# EAGLE design BMS (EAGLE 9.6.2)
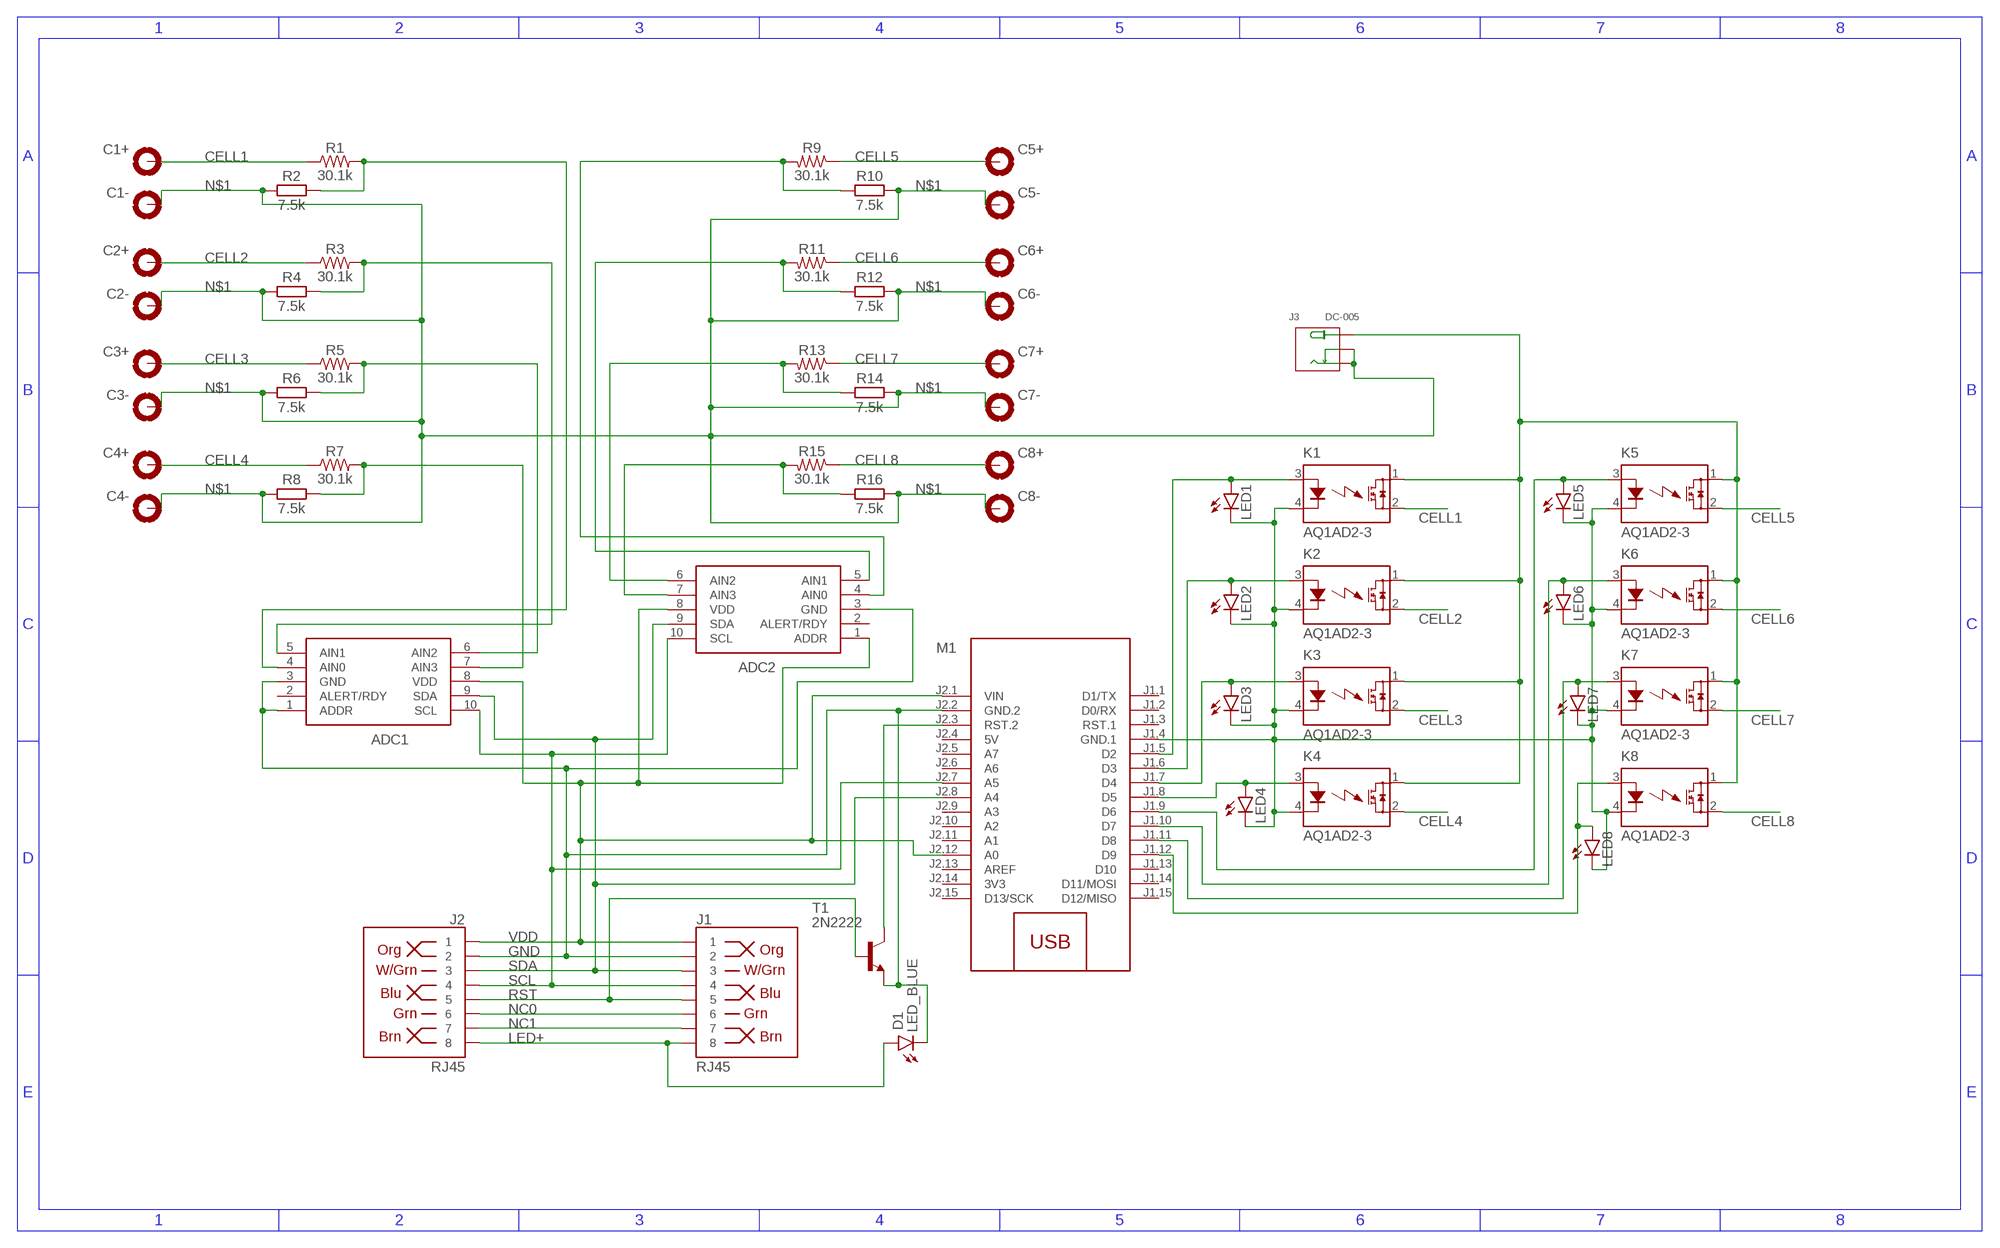
[diagram p0: schematic, sheet 1]

## Parts
ADC1  ADS1115IDGST  [SOP50P490X110-10N]
ADC2  ADS1115IDGST  [SOP50P490X110-10N]
C1+  HOLES_MOUNT-PAD-ROUND-0.096-NS  [HOLES_096-PAD-NS]
C1-  HOLES_MOUNT-PAD-ROUND-0.096-NS  [HOLES_096-PAD-NS]
C2+  HOLES_MOUNT-PAD-ROUND-0.096-NS  [HOLES_096-PAD-NS]
C2-  HOLES_MOUNT-PAD-ROUND-0.096-NS  [HOLES_096-PAD-NS]
C3+  HOLES_MOUNT-PAD-ROUND-0.096-NS  [HOLES_096-PAD-NS]
C3-  HOLES_MOUNT-PAD-ROUND-0.096-NS  [HOLES_096-PAD-NS]
C4+  HOLES_MOUNT-PAD-ROUND-0.096-NS  [HOLES_096-PAD-NS]
C4-  HOLES_MOUNT-PAD-ROUND-0.096-NS  [HOLES_096-PAD-NS]
C5+  HOLES_MOUNT-PAD-ROUND-0.096-NS  [HOLES_096-PAD-NS]
C5-  HOLES_MOUNT-PAD-ROUND-0.096-NS  [HOLES_096-PAD-NS]
C6+  HOLES_MOUNT-PAD-ROUND-0.096-NS  [HOLES_096-PAD-NS]
C6-  HOLES_MOUNT-PAD-ROUND-0.096-NS  [HOLES_096-PAD-NS]
C7+  HOLES_MOUNT-PAD-ROUND-0.096-NS  [HOLES_096-PAD-NS]
C7-  HOLES_MOUNT-PAD-ROUND-0.096-NS  [HOLES_096-PAD-NS]
C8+  HOLES_MOUNT-PAD-ROUND-0.096-NS  [HOLES_096-PAD-NS]
C8-  HOLES_MOUNT-PAD-ROUND-0.096-NS  [HOLES_096-PAD-NS]
D1  LED_BLUE  LED_RADIAL_BLUE  [LEDRD254W60D565H860B_B]
J1  RJ45  RJ45-8  [RJ45-8]
J2  RJ45  RJ45-8  [RJ45-8]
J3  DC-005  CONN-POWER-JACK-2.1MM(DC-005)  [DCJ3P-14.2X11.0X9.0MM]
K1  AQ1AD2-3  [AQ1]
K2  AQ1AD2-3  [AQ1]
K3  AQ1AD2-3  [AQ1]
K4  AQ1AD2-3  [AQ1]
K5  AQ1AD2-3  [AQ1]
K6  AQ1AD2-3  [AQ1]
K7  AQ1AD2-3  [AQ1]
K8  AQ1AD2-3  [AQ1]
LED1  LEDCHIP-LED0805  [CHIP-LED0805]
LED2  LEDCHIP-LED0805  [CHIP-LED0805]
LED3  LEDCHIP-LED0805  [CHIP-LED0805]
LED4  LEDCHIP-LED0805  [CHIP-LED0805]
LED5  LEDCHIP-LED0805  [CHIP-LED0805]
LED6  LEDCHIP-LED0805  [CHIP-LED0805]
LED7  LEDCHIP-LED0805  [CHIP-LED0805]
LED8  LEDCHIP-LED0805  [CHIP-LED0805]
M1  ARDUINO-NANO-3.0  [ARDUINO-NANO-3.0]
R1  30.1k  30.1KOHM-0603-1/10W-1%  [0603]
R2  7.5k  RESISTOR__CHIP-1206(3216-METRIC)  [RESC3216X70]
R3  30.1k  30.1KOHM-0603-1/10W-1%  [0603]
R4  7.5k  RESISTOR__CHIP-1206(3216-METRIC)  [RESC3216X70]
R5  30.1k  30.1KOHM-0603-1/10W-1%  [0603]
R6  7.5k  RESISTOR__CHIP-1206(3216-METRIC)  [RESC3216X70]
R7  30.1k  30.1KOHM-0603-1/10W-1%  [0603]
R8  7.5k  RESISTOR__CHIP-1206(3216-METRIC)  [RESC3216X70]
R9  30.1k  30.1KOHM-0603-1/10W-1%  [0603]
R10  7.5k  RESISTOR__CHIP-1206(3216-METRIC)  [RESC3216X70]
R11  30.1k  30.1KOHM-0603-1/10W-1%  [0603]
R12  7.5k  RESISTOR__CHIP-1206(3216-METRIC)  [RESC3216X70]
R13  30.1k  30.1KOHM-0603-1/10W-1%  [0603]
R14  7.5k  RESISTOR__CHIP-1206(3216-METRIC)  [RESC3216X70]
R15  30.1k  30.1KOHM-0603-1/10W-1%  [0603]
R16  7.5k  RESISTOR__CHIP-1206(3216-METRIC)  [RESC3216X70]
T1  2N2222  [TO18]

## Nets
C+ [New Class]: J3.+B(+) J3.+T(+) K1.1(DS1) K2.1(DS1) K3.1(DS1) K4.1(DS1) K5.1(DS1) K6.1(DS1) K7.1(DS1) K8.1(DS1)
CELL1 [New Class]: C1+.B096(MOUNT) K1.2(DS2) R1.1
CELL2 [New Class]: C2+.B096(MOUNT) K2.2(DS2) R3.1
CELL3 [New Class]: C3+.B096(MOUNT) K3.2(DS2) R5.1
CELL4 [New Class]: C4+.B096(MOUNT) K4.2(DS2) R7.1
CELL5 [New Class]: C5+.B096(MOUNT) K5.2(DS2) R9.1
CELL6 [New Class]: C6+.B096(MOUNT) K6.2(DS2) R11.1
CELL7 [New Class]: C7+.B096(MOUNT) K7.2(DS2) R13.1
CELL8 [New Class]: C8+.B096(MOUNT) K8.2(DS2) R15.1
GND: ADC1.1(ADDR) ADC1.3(GND) ADC2.3(GND) D1.2(C) J1.2 J2.2 M1.J2.2(GND.2) T1.1(E)
LED+: D1.1(A) J1.8 J2.8
N$1 [New Class]: C1-.B096(MOUNT) C2-.B096(MOUNT) C3-.B096(MOUNT) C4-.B096(MOUNT) C5-.B096(MOUNT) C6-.B096(MOUNT) C7-.B096(MOUNT) C8-.B096(MOUNT) J3.-1B(-) J3.-1T(-) J3.-2(CDN) J3.-2B(CDN) R2.1 R4.1 R6.1 R8.1 R10.1 R12.1 R14.1 R16.1
N$2: ADC1.7(AIN3) R7.2 R8.2
N$3: M1.J2.3(RST.2) T1.3(C)
N$4: K1.3(A) LED1.A M1.J1.5(D2)
N$7: K2.3(A) LED2.A M1.J1.6(D3)
N$8: K3.3(A) LED3.A M1.J1.7(D4)
N$13: K4.3(A) LED4.A M1.J1.8(D5)
N$14: K5.3(A) LED5.A M1.J1.9(D6)
N$15: K6.3(A) LED6.A M1.J1.10(D7)
N$16: K7.3(A) LED7.A M1.J1.11(D8)
N$17: K8.3(A) LED8.A M1.J1.12(D9)
N$18: K1.4(K) K2.4(K) K3.4(K) K4.4(K) K5.4(K) K6.4(K) K7.4(K) K8.4(K) LED1.C LED2.C LED3.C LED4.C LED5.C LED6.C LED7.C LED8.C M1.J1.4(GND.1)
N$19: ADC1.6(AIN2) R5.2 R6.2
N$20: ADC1.5(AIN1) R3.2 R4.2
N$21: ADC1.4(AIN0) R1.2 R2.2
N$24: ADC2.7(AIN3) R15.2 R16.2
N$25: ADC2.6(AIN2) R13.2 R14.2
N$26: ADC2.5(AIN1) R11.2 R12.2
N$27: ADC2.4(AIN0) R9.2 R10.2
NC0: J1.6 J2.6
NC1: J1.7 J2.7
RST: J1.5 J2.5 T1.2(B)
SCL: ADC1.10(SCL) ADC2.10(SCL) J1.4 J2.4 M1.J2.7(A5)
SDA: ADC1.9(SDA) ADC2.9(SDA) J1.3 J2.3 M1.J2.8(A4)
VDD: ADC1.8(VDD) ADC2.1(ADDR) ADC2.8(VDD) J1.1 J2.1 M1.J2.1(VIN) M1.J2.12(A0)
Unconnected: ADC1.2(ALERT/RDY) ADC2.2(ALERT/RDY) M1.J1.1(D1/TX) M1.J1.2(D0/RX) M1.J1.3(RST.1) M1.J1.13(D10) M1.J1.14(D11/MOSI) M1.J1.15(D12/MISO) M1.J2.5(A7) M1.J2.6(A6) M1.J2.9(A3) M1.J2.10(A2) M1.J2.11(A1) M1.J2.13(AREF) M1.J2.15(D13/SCK)

## Power pins joined to a net without a drawn wire
3V3: M1.J2.14(3V3)
5V: M1.J2.4(5V)

## Library data of the parts
ADC1 ADC2 = ADS1115IDGST:ADS1115IDGST: 16-Bit, 860SPS, 4-Ch Delta-Sigma ADC w/ PGA, Oscillator, Voltage Reference, Comparator & I2C Source: Datasheet <https://datasheet.datasheetarchive.com/originals/distributors/Datasheets-SFU2/DSASFU100025989.pdf>; ARROW_PART_NUMBER: ADS1115IDGST; ARROW_PRICE-STOCK: https://www.arrow.com/en/products/ads1115idgst/texas-instruments?region=nac; DESCRIPTION: 16-Bit, 860SPS, 4-Ch Delta-Sigma ADC w/ PGA, Oscillator, Voltage Reference, Comparator & I2C; HEIGHT: 1.1mm; MANUFACTURER_NAME: Texas Instruments; MANUFACTURER_PART_NUMBER: ADS1115IDGST; MOUSER_PART_NUMBER: 595-ADS1115IDGST; MOUSER_PRICE-STOCK: https://www.mouser.co.uk/ProductDetail/Texas-Instruments/ADS1115IDGST?qs=6805eV47HhY3JIwOhQ2zog%3D%3D
C1+ C1- C2+ C2- C3+ C3- C4+ C4- C5+ C5- C6+ C6- C7+ C7- C8+ C8- = LinkedLibrary52101:HOLES_MOUNT-PAD-ROUND-: MOUNTING PAD, round; BOM: EXCLUDE
D1 = Opto-Electronic:LED_RADIAL: LED - Generic; CATEGORY: Opto-Electronic; SUB-CATEGORY: LED
J1 J2 = SparkFun-Connectors:RJ45-8: RJ45 Jack - 8 pin Simple RJ45, 8-pin connection. Commonly used for Cat5, Cat5e, and Cat6 Ethernet cables. Here is the connector we sell at SparkFun: RJ45 8-Pin Connector <https://www.sparkfun.com/products/643> (PRT-00643) Datasheet <https://cdn.sparkfun.com/datasheets/Prototyping/04908.pdf> It is used on this SparkFun product: SparkFun RJ45 Breakout <https://www.sparkfun.com/products/716> (BOB-00716) Note, you may also be interested in the "MAGJACK" version of this. It is basically a RJ45 connector, but also has some status LEDs built into the connector housing. You can check that out in this library at the device named "MAGJACK.dev" and see these products online: RJ45 Ethernet MagJack-Compatible <https://www.sparkfun.com/products/8534> (PRT-08534) SparkFun RJ45 MagJack Breakout <https://www.sparkfun.com/products/13021> (BOB-13021); PROD_ID: CONN-08506; SF_ID: PRT-00643
J3 = OPL_Connector:CONN-POWER-JACK-2.1MM(DC-005): Seeed SKU 320120003 - DIP Black DC Jack 2.1MM MPN: DC-005 Important Notes: This part requires milling slots. Please make sure layer 46 Milling is included in the profile or outline layer when exporting Gerber files. Alternatively, you can use the built-in Seeed Fusion CAM file. Find it under Third-Party CAM files. Seeed Fusion PCBA OPL <https://www.seeedstudio.com/opl.html> Order PCB/PCBA Now <https://www.seeedstudio.com/fusion_pcb.html> www.seeedstudio.com; MPN: DC-005
K1-K8 = relay:AQ*: SOLID STATE RELAY NAiS Source: http://www.mew-europe.com/.. en_ds_61601_0000.pdf; MF: AROMAT/ MATSUSHITA; MPN: AQ1AD2-3/28VDC; OC_FARNELL: unknown; OC_NEWARK: 10C4052
LED1-LED8 = led:LED: LED OSRAM: - CHIPLED LG R971, LG N971, LY N971, LG Q971, LY Q971, LO R971, LY R971 LH N974, LH R974 LS Q976, LO Q976, LY Q976 LO Q996 - Hyper CHIPLED LW Q18S LB Q993, LB Q99A, LB R99A - SideLED LS A670, LO A670, LY A670, LG A670, LP A670 LB A673, LV A673, LT A673, LW A673 LH A674 LY A675 LS A676, LA A676, LO A676, LY A676, LW A676 LS A679, LY A679, LG A679 - Hyper Micro SIDELED® LS Y876, LA Y876, LO Y876, LY Y876 LT Y87S - SmartLED LW L88C, LW L88S LB L89C, LB L89S, LG L890 LS L89K, LO L89K, LY L89K LS L896, LA L896, LO L896, LY L896 - TOPLED LS T670, LO T670, LY T670, LG T670, LP T670 LSG T670, LSP T670, LSY T670, LOP T670, LYG T670 LG T671, LOG T671, LSG T671 LB T673, LV T673, LT T673, LW T673 LH T674 LS T676, LA T676, LO T676, LY T676, LB T676, LH T676, LSB T676, LW T676 LB T67C, LV T67C, LT T67C, LS T67K, LO T67K, LY T67K, LW E67C LS E67B, LA E67B, LO E67B, LY E67B, LB E67C, LV E67C, LT E67C LW T67C LS T679, LY T679, LG T679 LS T770, LO T770, LY T770, LG T770, LP T770 LB T773, LV T773, LT T773, LW T773 LH T774 LS E675, LA E675, LY E675, LS T675 LS T776, LA T776, LO T776, LY T776, LB T776 LHGB T686 LT T68C, LB T68C - Hyper Mini TOPLED® LB M676 - Mini TOPLED Santana® LG M470 LS M47K, LO M47K, LY M47K Source: http://www.osram.convergy.de LUXEON: - LUMILED® LXK2-PW12-R00, LXK2-PW12-S00, LXK2-PW14-U00, LXK2-PW14-V00 LXK2-PM12-R00, LXK2-PM12-S00, LXK2-PM14-U00 LXK2-PE12-Q00, LXK2-PE12-R00, LXK2-PE12-S00, LXK2-PE14-T00, LXK2-PE14-U00 LXK2-PB12-K00, LXK2-PB12-L00, LXK2-PB12-M00, LXK2-PB14-N00, LXK2-PB14-P00, LXK2-PB14-Q00 LXK2-PR12-L00, LXK2-PR12-M00, LXK2-PR14-Q00, LXK2-PR14-R00 LXK2-PD12-Q00, LXK2-PD12-R00, LXK2-PD12-S00 LXK2-PH12-R00, LXK2-PH12-S00 LXK2-PL12-P00, LXK2-PL12-Q00, LXK2-PL12-R00 Source: www.luxeon.com KINGBRIGHT: KA-3528ASYC Source: www.kingbright.com
M1 = diy-modules:ARDUINO-NANO-3.0: Arduino Nano 3.0 and compatible devices More details available here: https://www.arduino.cc/en/Main/ArduinoBoardNano Click here to find device on ebay.com <http://www.ebay.com/sch/arduino+nano>
R1 R3 R5 R7 R9 R11 R13 R15 = SparkFun-Resistors:30.1KOHM: 30.1kΩ resistor A resistor is a passive two-terminal electrical component that implements electrical resistance as a circuit element. Resistors act to reduce current flow, and, at the same time, act to lower voltage levels within circuits. - Wikipedia; PROD_ID: RES-08595
R2 R4 R6 R8 R10 R12 R14 R16 = Tinkercad:RESISTOR: Resistor Fixed - Generic; CATEGORY: Resistor; SUB-CATEGORY: Fixed
T1 = transistor:2N2222: NPN TRANSISTOR

## Net classes
1 New Class: width 1 mm, drill 1 mm, clearance 1 mm

## Board
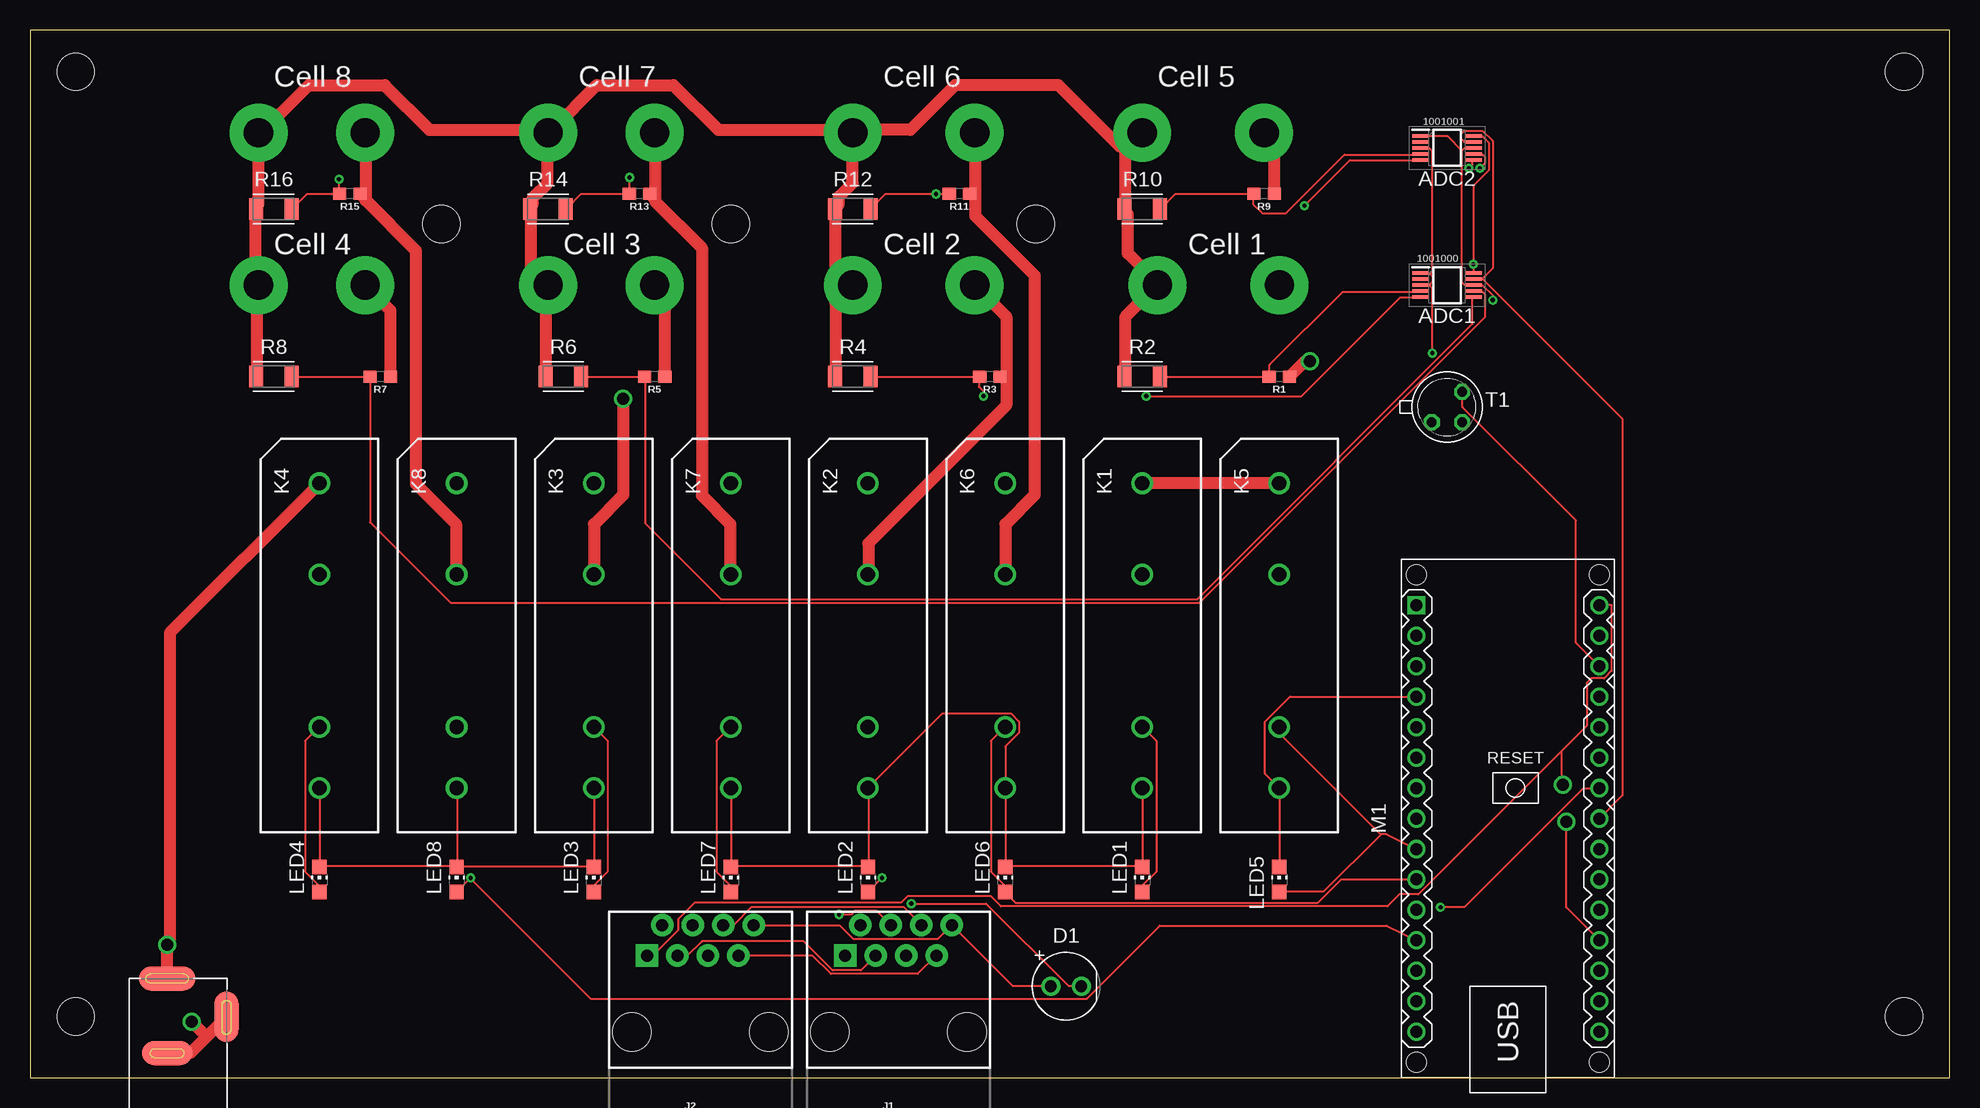
[diagram p1: board, top side]
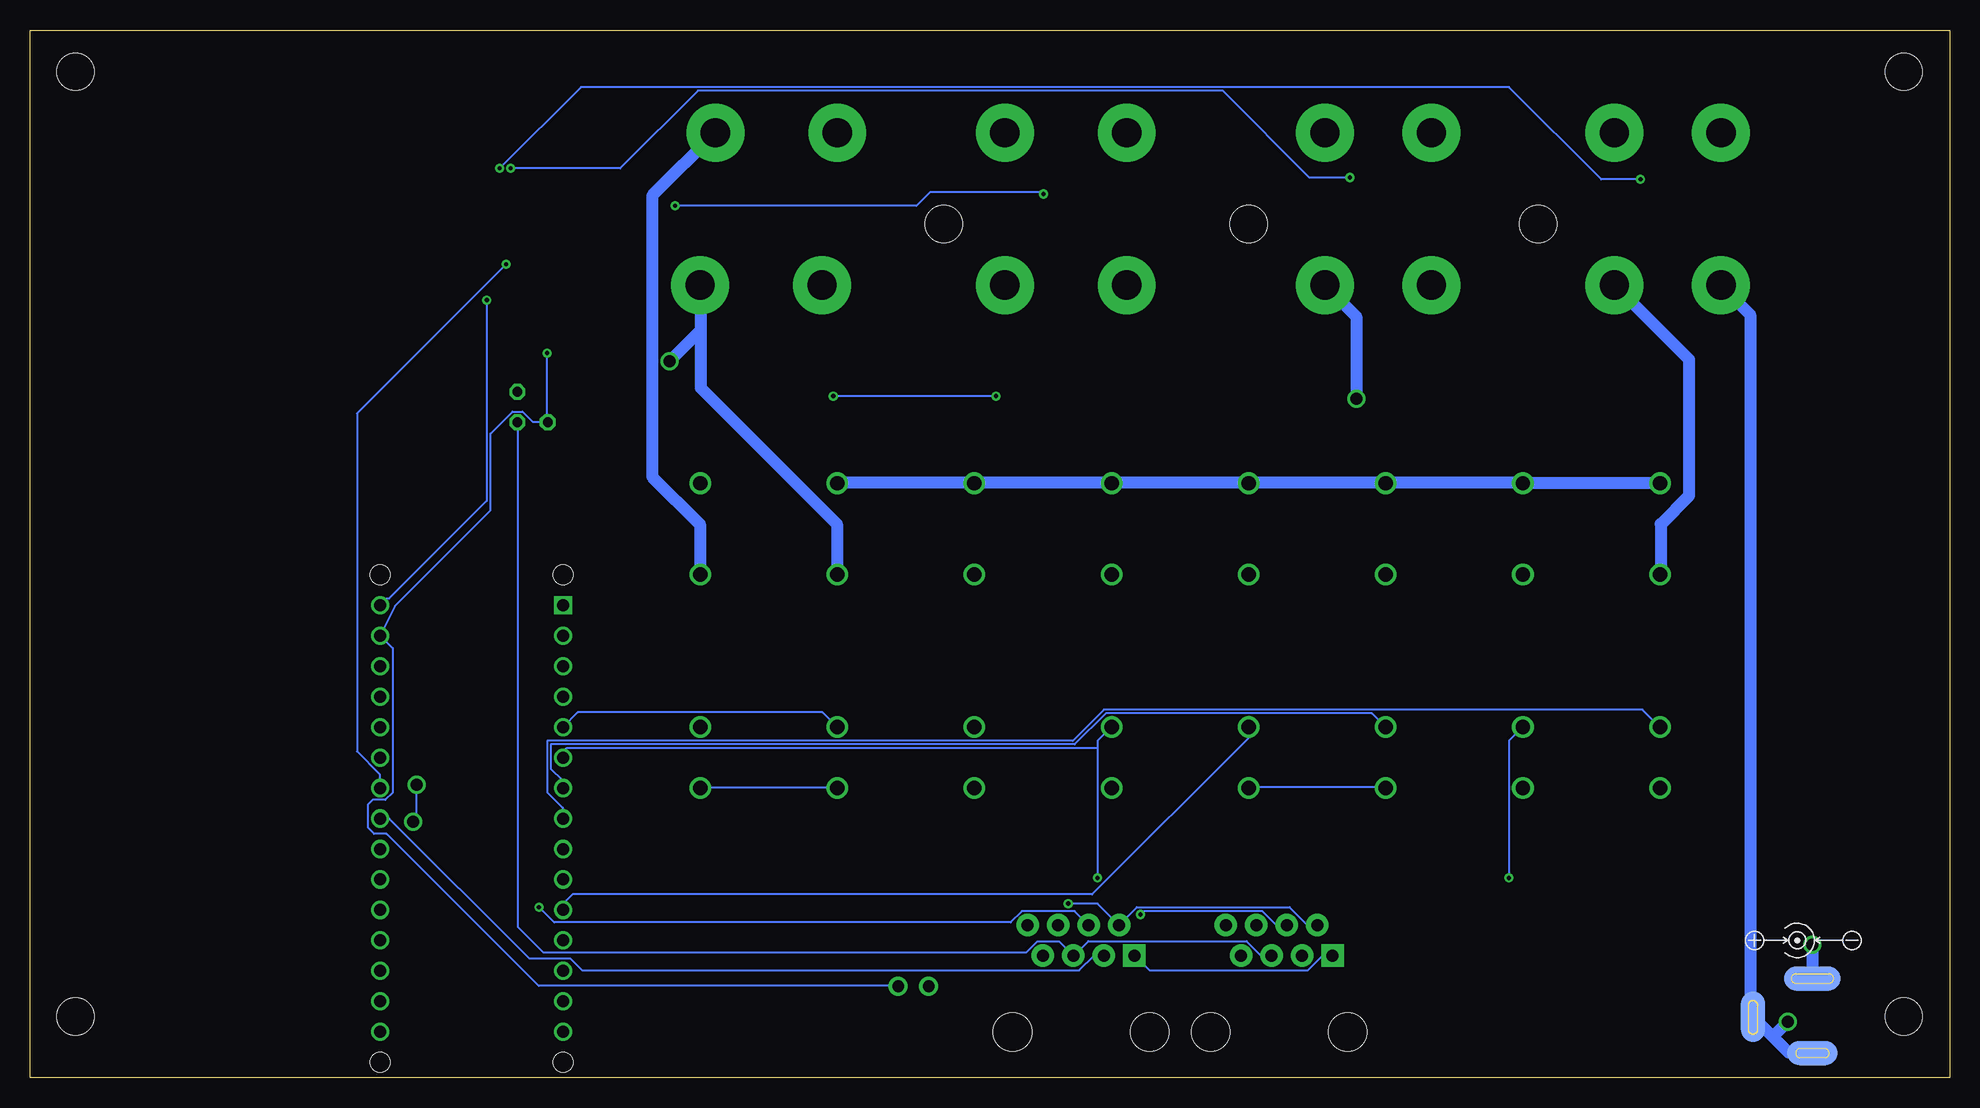
[diagram p2: board, bottom side, seen from below]

Size 160 x 87.3 mm. Coordinates in mm from the lower left corner, seen from the top.
Outline: 0,0 160,0 160,87.3 0,87.3 0,0
Copper layers (1*16): Top 0.035mm / dielectric 0.15mm / Bottom 0.035mm
Design rules "default *": minimum track width 6mil, minimum drill 0.35mm, track to track 6mil, track to pad 6mil, pad to pad 6mil, via to via 6mil, smd to smd 6mil, copper to edge 40mil, drill to drill 6mil, minimum pad ring 10mil, minimum via ring 8mil, stop-mask expansion 4mil, vias tented up to drill 0mil, thermal gap 10mil
Holes 3.1 mm at 3.81,5.08 3.81,83.82 156.21,83.82 156.21,5.08 83.82,71.12 58.42,71.12 34.29,71.12

### Footprints (pad centres in the part's own frame; a part is rotated, then mirrored left to right if it is on the bottom)
SOP50P490X110-10N = smd 1.4 x 0.3: 1 -2.2,1; 2 -2.2,0.5; 3 -2.2,0; 4 -2.2,-0.5; 5 -2.2,-1; 6 2.2,-1; 7 2.2,-0.5; 8 2.2,0; 9 2.2,0.5; 10 2.2,1
HOLES_096-PAD-NS = drill 2.438 pad 4.826: B096 0,0
LEDRD254W60D565H860B_B = drill 0.981 pad 1.581: 1 -1.27,0; 2 1.27,0
RJ45-8 = drill 1 pad 1.88 square: 1 -4.445,6.35 | drill 1 pad 1.88: 2 -3.175,8.89; 3 -1.905,6.35; 4 -0.635,8.89; 5 0.635,6.35; 6 1.905,8.89; 7 3.175,6.35; 8 4.445,8.89 | hole 3.2: -5.715,0; 5.715,0
DCJ3P-14.2X11.0X9.0MM = smd 2 x 4.7 bottom: +B 3.175,0 | smd 2 x 4.7: +T 3.175,0 | smd 2 x 4.2 bottom: -1B -3.048,0 | smd 2 x 4.2: -1T -3.048,0 | smd 4.2 x 2: -2 0,-4.953 | smd 4.2 x 2 bottom: -2B 0,-4.953
AQ1 = drill 1.2: 1 -12.7,0; 2 -5.08,0; 3 7.62,0; 4 12.7,0
CHIP-LED0805 = smd 1.2 x 1.2: A 0,-1.05; C 0,1.05
ARDUINO-NANO-3.0 = drill 1 square: J1.1 17.78,7.62 | drill 1: J1.2 15.24,7.62; J1.3 12.7,7.62; J1.4 10.16,7.62; J1.5 7.62,7.62; J1.6 5.08,7.62; J1.7 2.54,7.62; J1.8 0,7.62; J1.9 -2.54,7.62; J1.10 -5.08,7.62; J1.11 -7.62,7.62; J1.12 -10.16,7.62; J1.13 -12.7,7.62; J1.14 -15.24,7.62; J1.15 -17.78,7.62; J2.1 17.78,-7.62; J2.2 15.24,-7.62; J2.3 12.7,-7.62; J2.4 10.16,-7.62; J2.5 7.62,-7.62; J2.6 5.08,-7.62; J2.7 2.54,-7.62; J2.8 0,-7.62; J2.9 -2.54,-7.62; J2.10 -5.08,-7.62; J2.11 -7.62,-7.62; J2.12 -10.16,-7.62; J2.13 -12.7,-7.62; J2.14 -15.24,-7.62; J2.15 -17.78,-7.62 | hole 1.651: -20.32,7.62; -20.32,-7.62; 20.32,-7.62; 20.32,7.62
0603 = smd 1.1 x 1: 1 -0.85,0; 2 0.85,0
RESC3216X70 = smd 1.165 x 1.815: 1 -1.475,0; 2 1.475,0
TO18 = drill 0.813 octagon: 1 -1.27,-1.27; 2 1.27,-1.27; 3 1.27,1.27

### Placement (x,y rotation side)
ADC1  118.11,66.04 0 top
ADC2  118.11,77.47 0 top
C1+  104.14,66.04 0 top
C1-  93.98,66.04 0 top
C2+  78.74,66.04 0 top
C2-  68.58,66.04 0 top
C3+  52.07,66.04 0 top
C3-  43.18,66.04 0 top
C4+  27.94,66.04 0 top
C4-  19.05,66.04 0 top
C5+  102.87,78.74 0 top
C5-  92.71,78.74 0 top
C6+  78.74,78.74 0 top
C6-  68.58,78.74 0 top
C7+  52.07,78.74 0 top
C7-  43.18,78.74 0 top
C8+  27.94,78.74 0 top
C8-  19.05,78.74 0 top
D1  86.36,7.62 0 top
J1  72.39,3.81 0 top
J2  55.88,3.81 0 top
J3  11.43,5.08 90 top
K1  92.71,36.83 270 top
K2  69.85,36.83 270 top
K3  46.99,36.83 270 top
K4  24.13,36.83 270 top
K5  104.14,36.83 270 top
K6  81.28,36.83 270 top
K7  58.42,36.83 270 top
K8  35.56,36.83 270 top
LED1  92.71,16.51 0 top
LED2  69.85,16.51 0 top
LED3  46.99,16.51 0 top
LED4  24.13,16.51 0 top
LED5  104.14,16.51 0 top
LED6  81.28,16.51 0 top
LED7  58.42,16.51 0 top
LED8  35.56,16.51 0 top
M1  123.19,21.59 90 top
R1  104.14,58.42 180 top
R2  92.71,58.42 0 top
R3  80.01,58.42 180 top
R4  68.58,58.42 0 top
R5  52.07,58.42 180 top
R6  44.45,58.42 0 top
R7  29.21,58.42 180 top
R8  20.32,58.42 0 top
R9  102.87,73.66 180 top
R10  92.71,72.39 0 top
R11  77.47,73.66 180 top
R12  68.58,72.39 0 top
R13  50.8,73.66 180 top
R14  43.18,72.39 0 top
R15  26.67,73.66 180 top
R16  20.32,72.39 0 top
T1  118.11,55.88 0 top

### Tracks (layer width: path | path; a pad name or v marks a point on that pad's centre or on a via)
C+  (via drill 1)
  Top 1: J3.+T v11.43,11.07 11.66,11.53 11.66,37.06 K4.1 | K5.1 104.09,49.56 92.73,49.56 K1.1
  Bottom 1: v11.43,11.07 J3.+T | K4.1 24.16,49.56 35.51,49.56 K8.1 36.04,49.56 46.94,49.56 K3.1 47.47,49.56 58.37,49.56 K7.1 58.9,49.56 69.8,49.56 K2.1 70.33,49.56 81.23,49.56 K6.1 81.76,49.56 92.66,49.56 K1.1
CELL1  (via drill 1)
  Top 1: R1.1 106.26,59.69 v106.68,59.69
  Bottom 1: 104.09,62.23 104.09,66.02 C1+.B096 | 104.09,62.23 104.09,57.48 92.73,46.13 92.73,41.94 K1.2 | v106.68,59.69 104.14,62.23 104.09,62.23
CELL2
  Top 1: 81.38,58.42 81.38,63.42 78.79,66.02 C2+.B096 | 81.38,58.42 81.38,56.03 69.88,44.53 69.88,41.94 K2.2 | R3.1 81.38,58.42
CELL3  (via drill 1)
  Top 1: v49.45,56.57 49.45,48.56 47.02,46.13 47.02,41.94 K3.2 | R5.1 52.92,65.19 C3+.B096
  Bottom 1: v49.45,56.57 49.45,63.42 C3+.B096
CELL4
  Top 1: R7.1 30.06,63.92 C4+.B096
  Bottom 1: K4.2 24.08,41.94 24.08,46.13 21.72,48.49 21.72,59.84 27.89,66.02 C4+.B096
CELL5
  Top 1: R9.1 103.72,77.89 C5+.B096
  Bottom 1: C5+.B096 108.13,73.48 108.13,50.09 104.17,46.13 104.17,41.94 K5.2
CELL6
  Top 1: 78.79,73.66 78.79,78.74 C6+.B096 | 78.79,73.66 78.79,71.81 83.74,66.85 83.74,48.56 81.31,46.13 81.31,41.94 K6.2 | R11.1 78.79,73.66
CELL7
  Top 1: 52.12,73.19 52.12,78.74 C7+.B096 | K7.2 58.37,41.94 58.37,46.13 56.01,48.49 56.01,69.14 52.12,73.02 52.12,73.19 | R13.1 52.12,73.19
CELL8
  Top 1: 27.96,73.22 27.96,78.74 C8+.B096 | K8.2 35.51,41.94 35.51,46.13 32.16,49.48 32.16,68.91 27.96,73.1 27.96,73.22 | R15.1 27.96,73.22
GND  (via drill 0.35)
  Top 0.152: v73.46,14.5 79.7,14.5 86.56,7.64 87.63,7.64 D1.2 | 116.7,66.13 116.89,66.32 116.89,66.78 116.7,66.97 | 116.7,66.13 116.66,66.09 115.98,66.09 ADC1.3 | 116.7,66.97 116.66,67 115.98,67 ADC1.1 | 116.7,66.97 116.89,67.16 116.89,77.22 116.66,77.44 115.98,77.44 ADC2.3 | v116.89,60.38 116.89,65.79 116.74,65.94 116.74,66.09 116.7,66.13
  Bottom 0.152: v73.46,14.5 71.02,14.5 J1.2 69.19,12.75 67.74,14.2 55.02,14.2 53.57,12.75 52.73,12.75 J2.2 | 116.89,54.66 118.11,54.66 118.95,55.5 119.79,55.5 121.61,53.67 121.61,47.27 129.56,39.32 M1.J2.2 129.77,35.79 129.77,23.75 130.38,23.14 131.44,23.14 131.83,22.76 131.83,20.83 131.32,20.32 130.28,20.32 117.6,7.64 87.63,7.64 D1.2 | 116.89,54.66 v116.89,60.38 | 116.89,54.66 T1.1
LED+
  Top 0.152: D1.1 85.04,7.64 81.92,7.64 76.89,12.68 J1.8 75.67,11.53 68.66,11.53 67.51,12.68 60.35,12.68 J2.8
N$1  (via drill 1)
  Top 1: R4.1 67.13,58.47 67.13,64.57 68.58,66.02 C2-.B096 68.35,66.47 67.13,67.69 67.13,72.34 R12.1 67.44,72.8 67.44,73.41 68.58,74.55 C6-.B096 | R2.1 91.29,58.47 91.29,63.35 C1-.B096 93.73,66.47 91.52,68.68 91.52,71.96 R10.1 91.29,72.41 91.29,77.37 92.66,78.74 C5-.B096 90.83,77.6 85.72,82.7 77.11,82.7 73.38,78.97 69.04,78.97 C6-.B096 | R6.1 42.98,58.47 42.98,65.86 43.13,66.02 C3-.B096 42.9,66.47 41.76,67.61 41.76,72.34 R14.1 41.91,72.87 41.91,73.33 43.13,74.55 43.13,78.74 C7-.B096 | 14.74,3.42 16.38,5.05 J3.-2 | 14.74,3.42 13.41,2.08 11.43,2.08 J3.-1T | 14.74,3.42 v13.49,4.67 | R8.1 18.9,58.47 18.9,65.86 19.05,66.02 C4-.B096 18.82,66.47 18.82,72.34 R16.1 19.05,72.8 C8-.B096 19.51,78.97 23.24,82.7 29.57,82.7 33.3,78.97 42.67,78.97 C7-.B096 | C6-.B096 68.12,78.97 57.38,78.97 53.65,82.7 47.24,82.7 43.59,79.05 C7-.B096
  Bottom 1: 14.74,3.42 16.38,5.05 J3.-2 16.61,5.51 16.61,63.58 19.05,66.02 C4-.B096 | 14.74,3.42 13.41,2.08 11.43,2.08 J3.-1T | v13.49,4.67 14.74,3.42
N$2
  Top 0.152: R8.2 21.87,58.39 28.35,58.39 R7.2 28.35,58.32 28.35,46.28 35.05,39.57 97.46,39.57 121.31,63.42 121.31,65.25 121.08,65.48 120.32,65.48 ADC1.7
N$3
  Top 0.152: M1.J2.3 128.85,36.25 128.85,46.43 119.41,55.88 119.41,57.1 T1.3
N$4
  Top 0.152: LED1.A 92.73,15.49 92.73,16.03 93.88,17.17 93.88,28.07 92.73,29.21 K1.3
  Bottom 0.152: M1.J1.5 114.35,30.43 93.95,30.43 92.73,29.21 K1.3
N$7  (via drill 0.35)
  Top 0.152: v71.02,16.64 69.88,15.49 LED2.A
  Bottom 0.152: 71.02,27.46 71.02,28.07 69.88,29.21 K2.3 | 71.02,27.46 v71.02,16.64 | 71.02,27.46 115.27,27.46 115.32,27.43 115.57,27.18 M1.J1.6
N$8
  Top 0.152: LED3.A 47.02,15.49 47.02,16.03 48.16,17.17 48.16,28.07 47.02,29.21 K3.3
  Bottom 0.152: M1.J1.7 115.59,24.13 115.59,24.77 116.59,25.76 116.59,27.76 72.92,27.76 70.33,30.35 48.16,30.35 47.02,29.21 K3.3
N$13
  Top 0.152: LED4.A 24.08,15.49 24.08,16.03 22.94,17.17 22.94,28.07 24.08,29.21 K4.3
  Bottom 0.152: M1.J1.8 115.59,21.61 115.59,22.5 116.89,23.8 116.89,28.07 73.08,28.07 70.48,30.66 25.6,30.66 24.16,29.21 K4.3
N$14
  Top 0.152: 112.58,20.26 112.62,20.29 113.08,20.29 M1.J1.9 | 112.58,20.26 107.82,15.49 104.17,15.49 LED5.A | 112.58,20.26 104.17,28.68 104.17,29.21 K5.3
N$15
  Top 0.152: K6.3 81.23,29.21 80.09,28.07 80.09,17.17 81.23,16.03 81.23,15.49 LED6.A 81.31,15.42 82.14,14.58 107.37,14.58 109.3,16.51 M1.J1.10
N$16
  Top 0.152: LED7.A 58.37,15.49 58.37,16.03 57.23,17.17 57.23,28.07 58.37,29.21 K7.3
  Bottom 0.152: M1.J1.11 115.57,14.48 114.78,15.27 71.48,15.27 58.45,28.3 58.45,29.21 K7.3
N$17  (via drill 0.35)
  Top 0.152: LED8.A 35.59,15.49 v36.73,16.64 36.73,16.56 46.71,6.58 88.09,6.58 94.18,12.68 113.08,12.68 M1.J1.12
  Bottom 0.152: v36.73,16.64 36.73,28.07 35.59,29.21 K8.3
N$18
  Top 0.152: K1.4 92.73,24.11 92.73,17.63 LED1.C 92.66,17.63 81.38,17.63 LED6.C 81.31,17.63 81.31,24.11 K6.4 81.31,24.18 81.31,27.61 82.45,28.75 82.45,29.67 81.76,30.35 76.05,30.35 69.88,24.18 K2.4 69.88,24.11 69.88,17.63 LED2.C 69.8,17.63 58.52,17.63 LED7.C 58.45,17.63 58.45,24.11 K7.4 | LED5.C 104.17,17.63 104.17,24.11 K5.4 102.95,25.32 102.95,29.67 105.03,31.75 M1.J1.4 | K3.4 47.02,24.11 47.02,17.63 LED3.C 46.94,17.63 35.66,17.63 LED8.C | K4.4 24.16,24.11 24.16,17.63 LED4.C 24.23,17.63 35.51,17.63 LED8.C | LED8.C 35.59,17.63 35.59,24.11 K8.4
  Bottom 0.152: K1.4 92.73,24.18 104.09,24.18 K5.4 | K7.4 58.37,24.18 47.02,24.18 K3.4
N$19
  Top 0.152: R6.2 45.95,58.39 51.21,58.39 R5.2 51.28,58.39 51.28,46.2 57.61,39.88 97.31,39.88 120.24,62.81 120.24,65.02 ADC1.6
N$20  (via drill 0.35)
  Top 0.152: R4.2 70.1,58.39 79.1,58.39 R3.2 79.1,58.32 79.1,57.56 79.48,57.17 v79.48,56.79 | v93.04,56.79 105.99,56.79 114.22,65.02 115.9,65.02 ADC1.5
  Bottom 0.152: v79.48,56.79 v93.04,56.79
N$21
  Top 0.152: R2.2 94.26,58.39 103.25,58.39 R1.2 103.33,58.47 103.33,59.38 109.42,65.48 115.9,65.48 ADC1.4
N$24  (via drill 0.35)
  Top 0.152: R16.2 21.87,72.41 23.09,73.63 25.76,73.63 R15.2 25.76,73.71 v25.76,74.85 | v120.85,75.77 121.31,76.22 121.31,76.68 121.08,76.91 120.32,76.91 ADC2.7
  Bottom 0.152: v120.85,75.77 114.07,82.55 36.73,82.55 29.03,74.85 v25.76,74.85
N$25  (via drill 0.35)
  Top 0.152: R14.2 44.73,72.41 45.95,73.63 49.91,73.63 R13.2 49.99,73.71 v49.99,75.01 | v119.94,75.77 120.24,76.07 120.24,76.45 ADC2.6
  Bottom 0.152: v119.94,75.77 110.8,75.77 104.32,82.24 60.58,82.24 53.34,75.01 v49.99,75.01
N$26  (via drill 0.35)
  Top 0.152: R11.2 76.58,73.63 v75.51,73.63 71.32,73.63 70.1,72.41 R12.2 | v106.22,72.64 110.03,76.45 115.9,76.45 ADC2.5
  Bottom 0.152: v106.22,72.64 86.11,72.64 84.96,73.79 75.67,73.79 v75.51,73.63
N$27
  Top 0.152: R10.2 94.26,72.41 95.48,73.63 101.96,73.63 R9.2 101.96,73.56 101.96,72.8 102.72,72.03 104.7,72.03 109.58,76.91 115.9,76.91 ADC2.4
NC0
  Top 0.152: J2.6 57.84,12.75 58.67,12.75 60.12,14.2 72.85,14.2 74.3,12.75 J1.6
NC1
  Top 0.152: J2.7 65.23,10.16 66.75,8.64 73.99,8.64 75.51,10.16 J1.7
RST
  Bottom 0.152: T1.2 119.33,54.58 119.33,12.55 117.2,10.41 76.96,10.41 76.05,11.33 74.19,11.33 J1.5 73,10.16 71.78,11.38 58.6,11.38 57.38,10.16 J2.5
SCL  (via drill 0.35)
  Top 0.152: v67.44,13.59 68.43,13.59 68.73,13.89 70.56,13.89 J1.4 | ADC1.10 120.32,67.08 v120.32,67.77 120.32,74.32 121.61,75.62 121.61,77.9 121.08,78.44 120.32,78.44 ADC2.10 | v117.58,14.2 119.56,14.2 129.49,24.13 M1.J2.7
  Bottom 0.152: v67.44,13.59 67.13,13.89 57.3,13.89 56.16,12.75 55.24,12.75 J2.4 | v120.32,67.77 132.74,55.35 132.74,27.18 130.84,25.27 130.84,24.13 M1.J2.7 | v117.58,14.2 116.31,12.93 78.26,12.93 77.32,13.87 72.92,13.87 J1.4
SDA
  Top 0.152: J2.3 54.79,10.16 56.01,11.38 64.47,11.38 66.9,8.94 69.27,8.94 J1.3 | 121.04,66.59 121.92,67.46 121.92,78.05 121.08,78.89 119.56,78.89 119.33,78.66 119.33,78.21 119.56,77.98 120.24,77.98 ADC2.9 | 121.04,66.59 121.01,66.55 ADC1.9 | M1.J2.8 132.74,23.52 132.74,54.89 121.04,66.59
  Bottom 0.152: J1.3 71.32,10.16 72.54,8.94 113.97,8.94 114.96,9.93 118.39,9.93 130.05,21.59 M1.J2.8
VDD  (via drill 0.35, 1)
  Top 0.152: 119.37,77.25 119.56,77.44 120.24,77.44 ADC2.8 | 119.37,77.25 119.33,77.22 119.33,66.32 119.56,66.09 120.24,66.09 ADC1.8 120.32,66.02 121.08,66.02 121.92,65.18 v121.92,64.8 | 119.37,77.25 118.19,78.44 115.98,78.44 ADC2.1 | J2.1 51.89,10.16 54.03,12.29 54.03,13.21 55.4,14.58 72.62,14.58 73.15,15.11 80.09,15.11 80.92,14.28 113.16,14.28 114.15,15.27 115.72,15.27 127.7,27.24 | 127.7,27.24 129.77,29.31 129.77,32.89 130.15,33.27 131.22,33.27 131.83,33.88 131.83,39.37 M1.J2.1 | M1.J2.12 128.05,14.19 v128.05,21.3 | v127.76,24.38 127.7,24.45 127.7,27.24
  Bottom 0.152: J2.1 52.27,10.16 53.49,8.94 66.67,8.94 67.89,10.16 J1.1 | M1.J2.1 130.25,39.93 130.05,39.93 121.92,48.06 v121.92,64.8 | v128.05,21.3 127.76,21.59 v127.76,24.38

### Text on the board
tNames: Cell 8 | Cell 7 | Cell 6 | Cell 5 | 1001001 | Cell 4 | Cell 3 | Cell 2 | Cell 1 | 1001000